# EAGLE board Stimulation_Testbed_Core_V1__Ordered (EAGLE 7.5.0), part 1 of 3
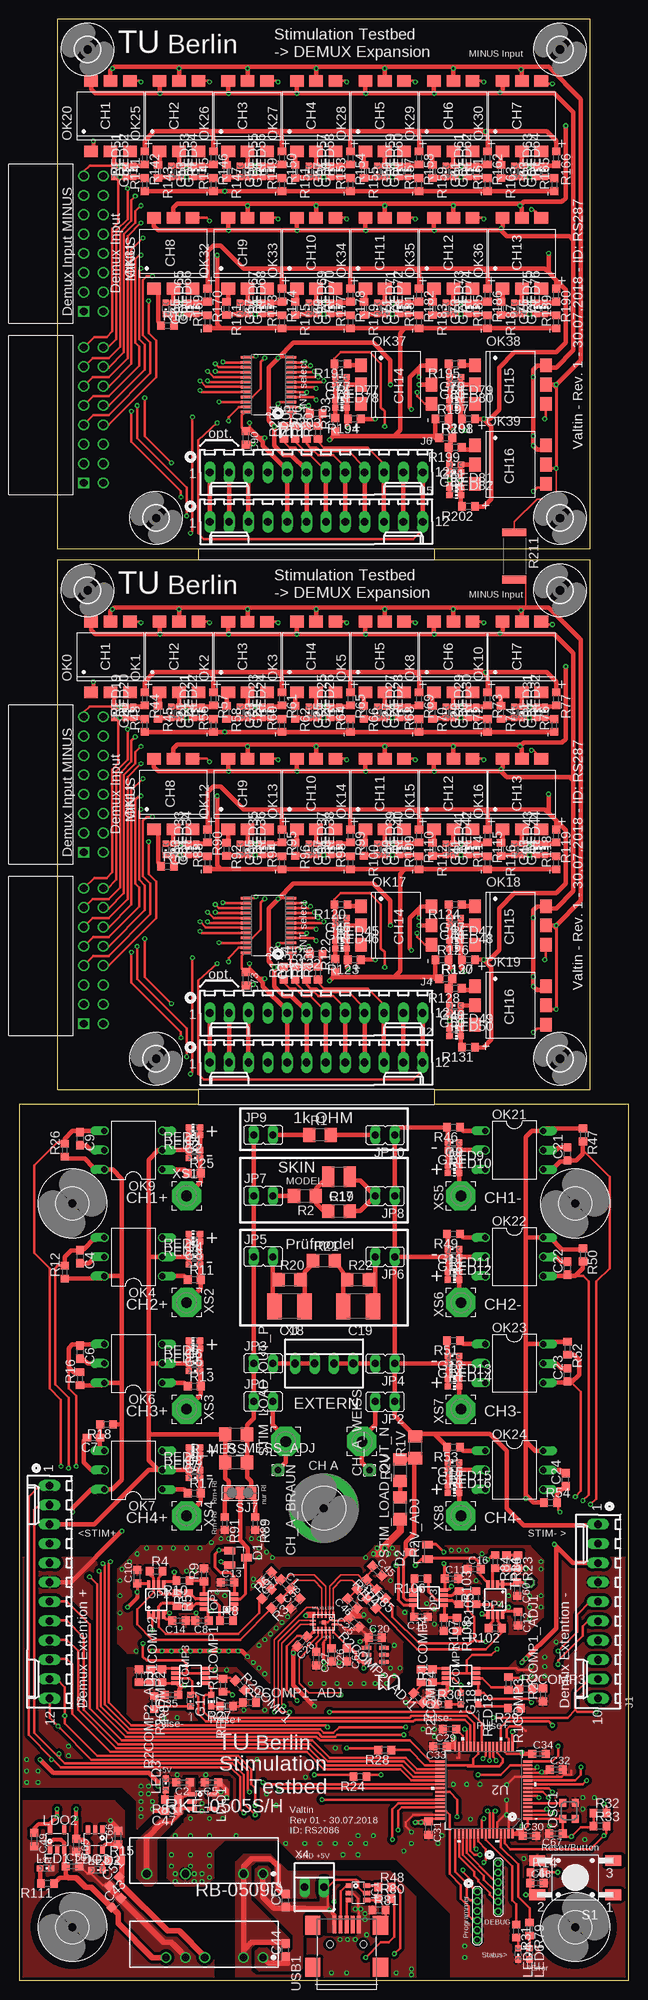
[diagram p5: board, top side]
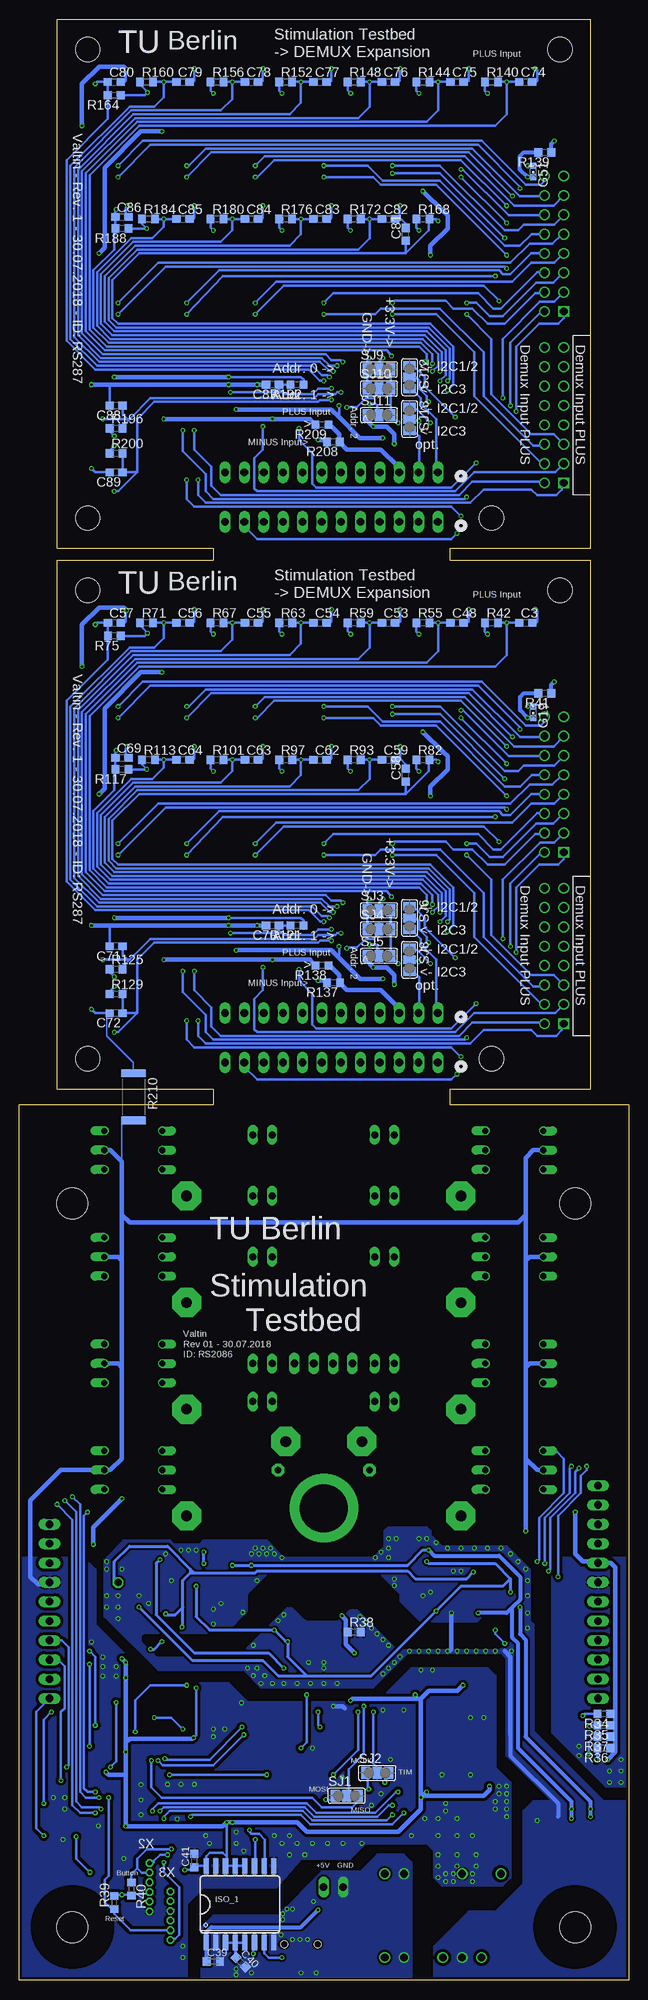
[diagram p6: board, bottom side, seen from below]

Size 80 x 257.5 mm. Coordinates in mm from the lower left corner, seen from the top.
Outline: 80,0 80,115 54.5,115 54.5,117 75,117 75,186.5 54.5,186.5 54.5,188 75,188 75,257.5 5,257.5 5,188 23.5,188 23.5,186.5 5,186.5 5,117 23.5,117 23.5,115 0,115 0,0 80,0
Copper layers (1*16): Top 0.035mm / dielectric 1.5mm / Bottom 0.035mm
Design rules "PCB-POOL Standard": minimum track width 0.15mm, minimum drill 0.3mm, track to track 0.15mm, track to pad 0.15mm, pad to pad 0.15mm, via to via 0.15mm, smd to smd 0.15mm, copper to edge 0.3mm, drill to drill 0.2mm, minimum pad ring 0.2mm, minimum via ring 0.15mm, stop-mask expansion 0.075mm, vias tented up to drill 0mil, thermal gap 0.2mm
tRestrict: area 34.8,47.8 to 44.5,53.8; area 29.2,46.8 to 31.5,51.4; area 28.9,43 to 33.6,47.5
bRestrict: area 15,43 to 63.5,53

## Footprints (pad centres in the part's own frame; a part is rotated, then mirrored left to right if it is on the bottom)
T1623CN+1 = smd 0.25 x 0.8: 1 -1.25,-1; 2 -0.75,-1; 3 -0.25,-1; 4 0.25,-1; 5 0.75,-1; 6 1.25,-1; 9 1.25,1; 10 0.75,1; 11 0.25,1; 12 -0.25,1; 13 -0.75,1; 14 -1.25,1 | smd 0.8 x 0.25: 7 1.45,-0.25; 8 1.45,0.25; 15 -1.45,0.25; 16 -1.45,-0.25 | smd 0.5 x 0.5: EXP 0,0
C0603K = smd 1.05 x 1.08: 1 -0.875,0; 2 0.875,0
C0603 = smd 1.1 x 1: 1 -0.85,0; 2 0.85,0
C1210 = smd 1.6 x 2.7: 1 -1.4,0; 2 1.4,0
C1812 = smd 1.9 x 3.4: 1 -1.95,0; 2 1.95,0
1,6/0,8 = drill 0.813 pad 1.6 octagon: 1 0,0
MSOP8 = smd 0.45 x 1: 1 -0.975,-2.05; 2 -0.325,-2.05; 3 0.325,-2.05; 4 0.975,-2.05; 5 0.975,2.05; 6 0.325,2.05; 7 -0.325,2.05; 8 -0.975,2.05
SOT23 = smd 1 x 1.4: 1 -0.95,-1.1; 2 0.95,-1.1; 3 0,1.1
MEJ2 = drill 1 pad 1.18: 1 0,0; 2 2.54,0; 5 10.16,0; 7 15.24,0
NMH = drill 1 pad 1.18: 1 0,0; 2 2.54,0; 4 7.62,0; 5 10.16,0; 6 12.7,0
CHIPLED_0603 = smd 0.8 x 0.8: A 0,-0.75; C 0,0.75
5,5-PAD = drill 6.3 pad 9: B6,3 0,0
SOT-23-6 = smd 0.6 x 0.9: 1 -0.95,-1.15; 2 0,-1.15; 3 0.95,-1.15; 4 0.95,1.15; 5 0,1.15; 6 -0.95,1.15
SOIC16WIDE = smd 0.66 x 2.032: 1 -4.445,-5.029; 2 -3.175,-5.029; 3 -1.905,-5.029; 4 -0.635,-5.029; 5 0.635,-5.029; 6 1.905,-5.029; 7 3.175,-5.029; 8 4.445,-5.029; 9 4.445,5.029; 10 3.175,5.029; 11 1.905,5.029; 12 0.635,5.029; 13 -0.635,5.029; 14 -1.905,5.029; 15 -3.175,5.029; 16 -4.445,5.029
6410-10 = drill 1.016 long: 1 11.43,0; 2 8.89,0; 3 6.35,0; 4 3.81,0; 5 1.27,0; 6 -1.27,0; 7 -3.81,0; 8 -6.35,0; 9 -8.89,0; 10 -11.43,0
6410-12 = drill 1.016 long: 1 13.97,0; 2 11.43,0; 3 8.89,0; 4 6.35,0; 5 3.81,0; 6 1.27,0; 7 -1.27,0; 8 -3.81,0; 9 -6.35,0; 10 -8.89,0; 11 -11.43,0; 12 -13.97,0
JP1 = drill 0.914 long: 1 0,-1.27; 2 0,1.27
613016243121 = drill 1.02 square: 1 -8.89,0 | drill 1.02: 2 -6.35,0; 3 -3.81,0; 4 -1.27,0; 5 1.27,0; 6 3.81,0; 7 6.35,0; 8 8.89,0; 9 8.89,-2.54; 10 6.35,-2.54; 11 3.81,-2.54; 12 1.27,-2.54; 13 -1.27,-2.54; 14 -3.81,-2.54; 15 -6.35,-2.54; 16 -8.89,-2.54
SOT-23-5 = smd 0.55 x 1.2: 1 -0.95,-1.3; 2 0,-1.3; 3 0.95,-1.3; 4 0.95,1.3; 5 -0.95,1.3
DIL6-SMD = smd 1.78 x 1.52: 1 -2.54,-4.645; 2 0,-4.645; 3 2.54,-4.645; 4 2.54,4.645; 5 0,4.645; 6 -2.54,4.645
DIL06 = drill 0.813 offset: 1 -2.54,-3.81; 2 0,-3.81; 3 2.54,-3.81; 4 2.54,3.81; 5 0,3.81; 6 -2.54,3.81
OSC_2.5X2 = smd 1 x 0.9: 1 -1.05,-0.825; 2 1.05,-0.825; 3 1.05,0.825; 4 -1.05,0.825
R1206 = smd 1.6 x 1.803: 1 -1.422,0; 2 1.422,0
R0603 = smd 1 x 1.1: 1 -0.85,0; 2 0.85,0
R6332 = smd 1 x 3.2: 1 -3.1,0; 2 3.1,0
CHIP-LED0603 = smd 0.8 x 0.8: A 0,-0.75; C 0,0.75
TAST_SMD = smd 2.1 x 1.4: 1 -5,2.25; 2 5,2.25; 3 -5,-2.25; 4 5,-2.25
SJ_2 = smd 1.168 x 1.6: 1 -1.524,0; 2 0,0; 3 1.524,0
3,81/1,4 = drill 1.397 pad 3.81 octagon: 1 0,0
TP1-09 = drill 0.9 pad 1.4 octagon: TP 0,0
SOT95P280X100-6N = smd 1.219 x 0.508: 1 -1.143,0.94; 2 -1.143,0; 3 -1.143,-0.94; 4 1.143,-0.94; 5 1.143,0; 6 1.143,0.94
LQFP64-10X10MM = smd 1.194 x 0.305: 1 -5.75,3.75; 2 -5.75,3.25; 3 -5.75,2.75; 4 -5.75,2.25; 5 -5.75,1.75; 6 -5.75,1.25; 7 -5.75,0.75; 8 -5.75,0.25; 9 -5.75,-0.25; 10 -5.75,-0.75; 11 -5.75,-1.25; 12 -5.75,-1.75; 13 -5.75,-2.25; 14 -5.75,-2.75; 15 -5.75,-3.25; 16 -5.75,-3.75; 33 5.75,-3.75; 34 5.75,-3.25; 35 5.75,-2.75; 36 5.75,-2.25; 37 5.75,-1.75; 38 5.75,-1.25; 39 5.75,-0.75; 40 5.75,-0.25; 41 5.75,0.25; 42 5.75,0.75; 43 5.75,1.25; 44 5.75,1.75; 45 5.75,2.25; 46 5.75,2.75; 47 5.75,3.25; 48 5.75,3.75 | smd 0.305 x 1.194: 17 -3.75,-5.75; 18 -3.25,-5.75; 19 -2.75,-5.75; 20 -2.25,-5.75; 21 -1.75,-5.75; 22 -1.25,-5.75; 23 -0.75,-5.75; 24 -0.25,-5.75; 25 0.25,-5.75; 26 0.75,-5.75; 27 1.25,-5.75; 28 1.75,-5.75; 29 2.25,-5.75; 30 2.75,-5.75; 31 3.25,-5.75; 32 3.75,-5.75; 49 3.75,5.75; 50 3.25,5.75; 51 2.75,5.75; 52 2.25,5.75; 53 1.75,5.75; 54 1.25,5.75; 55 0.75,5.75; 56 0.25,5.75; 57 -0.25,5.75; 58 -0.75,5.75; 59 -1.25,5.75; 60 -1.75,5.75; 61 -2.25,5.75; 62 -2.75,5.75; 63 -3.25,5.75; 64 -3.75,5.75
SOP65P640X120-24N = smd 1.473 x 0.356: 1 -2.921,3.581; 2 -2.921,2.921; 3 -2.921,2.286; 4 -2.921,1.626; 5 -2.921,0.965; 6 -2.921,0.33; 7 -2.921,-0.33; 8 -2.921,-0.965; 9 -2.921,-1.626; 10 -2.921,-2.286; 11 -2.921,-2.921; 12 -2.921,-3.581; 13 2.921,-3.581; 14 2.921,-2.921; 15 2.921,-2.286; 16 2.921,-1.626; 17 2.921,-0.965; 18 2.921,-0.33; 19 2.921,0.33; 20 2.921,0.965; 21 2.921,1.626; 22 2.921,2.286; 23 2.921,2.921; 24 2.921,3.581
4,1 = hole 4.1: 0,0
3,2 = hole 3.2: 0,0
TE_1-1734035-1 = smd 0.5 x 2.3: 1 -1.6,7.85; 2 -0.8,7.85; 3 0,7.85; 4 0.8,7.85; 5 1.6,7.85 | smd 2 x 2.5: 7 4.45,7.75; 8 -4.45,7.75; 9 -4.45,2.25; 10 4.45,2.25 | hole 0.9: -2.2,5.25; 2.2,5.25
22-23-2041 = drill 1 long: 1 -3.81,0; 2 -1.27,0; 3 1.27,0; 4 3.81,0
1.27_1X06_S = drill 0.6 pad 0.813 octagon: P1 0.635,3.175; P2 0.635,1.905; P3 0.635,0.635; P4 0.635,-0.635; P5 0.635,-1.905; P6 0.635,-3.175
22-23-2021 = drill 1 long: 1 -1.27,0; 2 1.27,0

## Placement (x,y rotation side)
ADC1  MAX11198  [T1623CN+1]  40,47 180 top
C1  1nF/25V/C0G/5%  [C0603K]  35,52 315 top
C2  1uF/25V/X7R/10%  [C0603K]  21.5,26 180 top
C3  1nF/25V/X7R/10%  [C0603]  13.5,178.25 0 bottom
C4  1nF/25V/X7R/10%  [C0603]  8,95 270 top
C5  1uF/25V/X7R/10%  [C0603K]  25.25,26 180 top
C6  1nF/25V/X7R/10%  [C0603]  8,82.5 270 top
C7  1nF/25V/X7R/10%  [C0603]  9.75,71.25 180 top
C8  100nF/25V/X7R/10%  [C0603K]  24,47.25 180 top
C9  1nF/25V/X7R/10%  [C0603]  8,110.5 270 top
C10  100nF/25V/X7R/10%  [C0603K]  15.5,53 90 top
C11  100nF/25V/X7R/10%  [C0603K]  56.75,52.75 0 top
C12  100nF/25V/X7R/10%  [C0603K]  65.5,47.5 270 top
C13  100nF/25V/X7R/10%  [C0603K]  27.38,52.25 0 top
C14  100nF/25V/X7R/10%  [C0603K]  21,47.25 180 top
C15  100nF/25V/X7R/10%  [C0603K]  52.75,47.75 180 top
C16  100nF/25V/X7R/10%  [C0603K]  59.75,54 0 top
C17  220nF/250V/X7R/10%  [C1210]  42,105.5 180 top
C18  330nF/250V/X7R/10%  [C1812]  35.5,88.5 180 top
C19  330nF/250V/X7R/10%  [C1812]  44.5,88.5 180 top
C20  100nF/25V/X7R/10%  [C0603K]  46.75,45 0 top
C21  1nF/25V/X7R/10%  [C0603]  72,108.5 90 top
C22  1nF/25V/X7R/10%  [C0603]  72,93.5 90 top
C23  1nF/25V/X7R/10%  [C0603]  72,79.5 90 top
C24  1nF/25V/X7R/10%  [C0603]  71.75,65.75 90 top
C25  10uF/25V/X7R/10%  [C0603K]  44,47 135 top
C26  10uF/25V/X7R/10%  [C0603K]  41,42.75 270 top
C27  10uF/25V/X7R/10%  [C0603K]  39,42.25 270 top
C28  10uF/25V/X7R/10%  [C0603K]  37.15,44.5 225 top
C29  4.7uF/25V/X7R/10%  [C0603K]  56.5,33 180 top
C30  4.7uF/25V/X7R/10%  [C0603K]  67,19 0 top
C31  4.7uF/25V/X7R/10%  [C0603K]  53.75,20 270 top
C32  4.7uF/25V/X7R/10%  [C0603K]  70.5,27.7 0 top
C33  4.7uF/25V/X7R/10%  [C0603K]  55.25,30.75 180 top
C34  4.7uF/25V/X7R/10%  [C0603K]  68.25,29.75 0 top
C35  100nF/25V/X7R/10%  [C0603K]  20,37.5 180 top
C36  100nF/25V/X7R/10%  [C0603K]  54.75,37.75 180 top
C37  0.1nF/25V/C0G/5%  [C0603K]  32.5,53 225 top
C38  0.1nF/25V/C0G/5%  [C0603K]  36.25,49.5 45 top
C39  100nF/25V/X7R/10%  [C0603K]  54.5,2.5 0 bottom
C40  100nF/25V/X7R/10%  [C0603K]  50.9,2.4 315 bottom
C41  100nF/25V/X7R/10%  [C0603K]  57,15.75 90 bottom
C42  1nF/25V/C0G/5%  [C0603K]  45,52 225 top
C43  4.7u/25V/X7R  [C0603]  12.77,10.2 45 top
C44  4.7u/15V/X7R  [C0603]  35,4 90 top
C45  0.1nF/25V/C0G/5%  [C0603K]  47,53.75 315 top
C46  0.1nF/25V/C0G/5%  [C0603K]  43.75,49.5 135 top
C47  4.7u/25V/X7R  [C0603]  20,22.25 180 top
C48  1nF/25V/X7R/10%  [C0603]  22.5,178.25 0 bottom
C49  1uF/25V/X7R/10%  [C0603K]  2,18.5 270 top
C50  1uF/25V/X7R/10%  [C0603K]  7,15 0 top
C51  4.7u/25V/X7R  [C0603]  12.5,13 45 top
C52  4.7u/25V/X7R  [C0603]  35,10.5 90 top
C53  1nF/25V/X7R/10%  [C0603]  31.5,178.25 0 bottom
C54  1nF/25V/X7R/10%  [C0603]  40.5,178.25 0 bottom
C55  1nF/25V/X7R/10%  [C0603]  49.5,178.25 0 bottom
C56  1nF/25V/X7R/10%  [C0603]  58.5,178.25 0 bottom
C57  1nF/25V/X7R/10%  [C0603]  67.5,178.25 0 bottom
C58  1nF/25V/X7R/10%  [C0603]  29.25,158.25 90 bottom
C59  1nF/25V/X7R/10%  [C0603]  31.5,160.25 0 bottom
C60  NC -> can't handle C load  [C0603K]  65.39,51.36 270 top
C61  1uF/25V/X7R/10%  [C0603K]  43,42.75 270 top
C62  1nF/25V/X7R/10%  [C0603]  40.5,160.25 0 bottom
C63  1nF/25V/X7R/10%  [C0603]  49.5,160.25 0 bottom
C64  1nF/25V/X7R/10%  [C0603]  58.5,160.25 0 bottom
C65  4.7uF/25V/X7R/10%  [C0603K]  7.5,17.75 270 top
C66  1uF/25V/X7R/10%  [C0603K]  13,18.75 90 top
C67  100nF/25V/X7R/10%  [C0603K]  70.48,19.28 180 top
C68  100nF/25V/X7R/10%  [C0603K]  68,12.8 0 top
C69  1nF/25V/X7R/10%  [C0603]  66.5,160.5 0 bottom
C70  1nF/25V/X7R/10%  [C0603]  46.75,138.5 180 bottom
C71  1nF/25V/X7R/10%  [C0603]  67.25,135.75 180 bottom
C72  1nF/25V/X7R/10%  [C0603]  67.25,127 180 bottom
C73  100nF/25V/X7R/10%  [C0603K]  29.75,131.5 270 top
C74  1nF/25V/X7R/10%  [C0603]  13.5,249.25 0 bottom
C75  1nF/25V/X7R/10%  [C0603]  22.5,249.25 0 bottom
C76  1nF/25V/X7R/10%  [C0603]  31.5,249.25 0 bottom
C77  1nF/25V/X7R/10%  [C0603]  40.5,249.25 0 bottom
C78  1nF/25V/X7R/10%  [C0603]  49.5,249.25 0 bottom
C79  1nF/25V/X7R/10%  [C0603]  58.5,249.25 0 bottom
C80  1nF/25V/X7R/10%  [C0603]  67.5,249.25 0 bottom
C81  1nF/25V/X7R/10%  [C0603]  29.25,229.25 90 bottom
C82  1nF/25V/X7R/10%  [C0603]  31.5,231.25 0 bottom
C83  1nF/25V/X7R/10%  [C0603]  40.5,231.25 0 bottom
C84  1nF/25V/X7R/10%  [C0603]  49.5,231.25 0 bottom
C85  1nF/25V/X7R/10%  [C0603]  58.5,231.25 0 bottom
C86  1nF/25V/X7R/10%  [C0603]  66.5,231.5 0 bottom
C87  1nF/25V/X7R/10%  [C0603]  46.75,209.5 180 bottom
C88  1nF/25V/X7R/10%  [C0603]  67.25,206.75 180 bottom
C89  1nF/25V/X7R/10%  [C0603]  67.25,198 180 bottom
C90  100nF/25V/X7R/10%  [C0603K]  29.75,202.5 270 top
CH_A_BRAUN  [1,6/0,8]  34,67 270 top
CH_A_WEISS  [1,6/0,8]  46,67 90 top
COMP1  TS3022IST  [MSOP8]  58,40 90 top
COMP3  TS3022IST  [MSOP8]  22.5,40 90 top
D1  BAS70-04  [SOT23]  28.75,55.5 270 top
D2  BAS70-04  [SOT23]  52.5,56.25 90 top
DC-DC_3V3  RKE-0505S/H  [MEJ2]  32,14 180 top
DC-DC_9V  RB-0509D  [NMH]  32,3 180 top
G1  150060VS75000  [CHIPLED_0603]  23,109 270 top
G2  150060VS75000  [CHIPLED_0603]  23,108 270 top
G3  150060VS75000  [CHIPLED_0603]  23,94 270 top
G4  150060VS75000  [CHIPLED_0603]  23,95 270 top
G5  150060VS75000  [CHIPLED_0603]  23,80 270 top
G6  150060VS75000  [CHIPLED_0603]  23,81 270 top
G7  150060VS75000  [CHIPLED_0603]  23,66 270 top
G8  150060VS75000  [CHIPLED_0603]  23,67 270 top
G9  150060VS75000  [CHIPLED_0603]  57,110 90 top
G10  150060VS75000  [CHIPLED_0603]  57,109 90 top
G11  150060VS75000  [CHIPLED_0603]  57,96 90 top
G12  150060VS75000  [CHIPLED_0603]  57,95 90 top
G13  150060VS75000  [CHIPLED_0603]  57,82 90 top
G14  150060VS75000  [CHIPLED_0603]  57,81 90 top
G15  150060VS75000  [CHIPLED_0603]  57,68 90 top
G16  150060VS75000  [CHIPLED_0603]  57,67 90 top
G17  150060VS75000  [CHIPLED_0603]  22.5,36.75 180 top
G18  150060VS75000  [CHIPLED_0603]  58,37 180 top
G19  150060VS75000  [CHIPLED_0603]  12.5,166.5 180 bottom
G20  150060VS75000  [CHIPLED_0603]  12.5,166.5 180 top
G21  150060VS75000  [CHIPLED_0603]  20,166.5 180 top
G22  150060VS75000  [CHIPLED_0603]  21,166.5 180 top
G23  150060VS75000  [CHIPLED_0603]  29,166.49 180 top
G24  150060VS75000  [CHIPLED_0603]  30,166.49 180 top
G25  150060VS75000  [CHIPLED_0603]  38,166.5 180 top
G26  150060VS75000  [CHIPLED_0603]  39,166.5 180 top
G27  150060VS75000  [CHIPLED_0603]  47,166.5 180 top
G28  150060VS75000  [CHIPLED_0603]  48,166.5 180 top
G29  150060VS75000  [CHIPLED_0603]  56,166.5 180 top
G30  150060VS75000  [CHIPLED_0603]  57,166.5 180 top
G31  150060VS75000  [CHIPLED_0603]  65,166.5 180 top
G32  150060VS75000  [CHIPLED_0603]  66,166.5 180 top
G33  150060VS75000  [CHIPLED_0603]  19.25,148.5 180 top
G34  150060VS75000  [CHIPLED_0603]  20.25,148.5 180 top
G35  150060VS75000  [CHIPLED_0603]  29,148.5 180 top
G36  150060VS75000  [CHIPLED_0603]  30,148.5 180 top
G37  150060VS75000  [CHIPLED_0603]  38,148.5 180 top
G38  150060VS75000  [CHIPLED_0603]  39,148.5 180 top
G39  150060VS75000  [CHIPLED_0603]  47,148.5 180 top
G40  150060VS75000  [CHIPLED_0603]  48,148.5 180 top
G41  150060VS75000  [CHIPLED_0603]  56,148.5 180 top
G42  150060VS75000  [CHIPLED_0603]  57,148.5 180 top
G43  150060VS75000  [CHIPLED_0603]  65,148.5 180 top
G44  150060VS75000  [CHIPLED_0603]  66,148.5 180 top
G45  150060VS75000  [CHIPLED_0603]  42.25,139.5 90 top
G46  150060VS75000  [CHIPLED_0603]  42.25,138.5 90 top
G47  150060VS75000  [CHIPLED_0603]  57.25,139.5 90 top
G48  150060VS75000  [CHIPLED_0603]  57.25,138.5 90 top
G49  150060VS75000  [CHIPLED_0603]  57.25,128 90 top
G50  150060VS75000  [CHIPLED_0603]  57.25,127 90 top
G51  150060VS75000  [CHIPLED_0603]  12.5,237.5 180 bottom
G52  150060VS75000  [CHIPLED_0603]  12.5,237.5 180 top
G53  150060VS75000  [CHIPLED_0603]  20,237.5 180 top
G54  150060VS75000  [CHIPLED_0603]  21,237.5 180 top
G55  150060VS75000  [CHIPLED_0603]  29,237.49 180 top
G56  150060VS75000  [CHIPLED_0603]  30,237.49 180 top
G57  150060VS75000  [CHIPLED_0603]  38,237.5 180 top
G58  150060VS75000  [CHIPLED_0603]  39,237.5 180 top
G59  150060VS75000  [CHIPLED_0603]  47,237.5 180 top
G60  150060VS75000  [CHIPLED_0603]  48,237.5 180 top
G61  150060VS75000  [CHIPLED_0603]  56,237.5 180 top
G62  150060VS75000  [CHIPLED_0603]  57,237.5 180 top
G63  150060VS75000  [CHIPLED_0603]  65,237.5 180 top
G64  150060VS75000  [CHIPLED_0603]  66,237.5 180 top
G65  150060VS75000  [CHIPLED_0603]  19.25,219.5 180 top
G66  150060VS75000  [CHIPLED_0603]  20.25,219.5 180 top
G67  150060VS75000  [CHIPLED_0603]  29,219.5 180 top
G68  150060VS75000  [CHIPLED_0603]  30,219.5 180 top
G69  150060VS75000  [CHIPLED_0603]  38,219.5 180 top
G70  150060VS75000  [CHIPLED_0603]  39,219.5 180 top
G71  150060VS75000  [CHIPLED_0603]  47,219.5 180 top
G72  150060VS75000  [CHIPLED_0603]  48,219.5 180 top
G73  150060VS75000  [CHIPLED_0603]  56,219.5 180 top
G74  150060VS75000  [CHIPLED_0603]  57,219.5 180 top
G75  150060VS75000  [CHIPLED_0603]  65,219.5 180 top
G76  150060VS75000  [CHIPLED_0603]  66,219.5 180 top
G77  150060VS75000  [CHIPLED_0603]  42.25,210.5 90 top
G78  150060VS75000  [CHIPLED_0603]  42.25,209.5 90 top
G79  150060VS75000  [CHIPLED_0603]  57.25,210.5 90 top
G80  150060VS75000  [CHIPLED_0603]  57.25,209.5 90 top
G81  150060VS75000  [CHIPLED_0603]  57.25,199 90 top
G82  150060VS75000  [CHIPLED_0603]  57.25,198 90 top
H1  BINDER_STIM  [5,5-PAD]  40,62 270 top
IC1  USBLC6-2  [SOT-23-6]  44.5,11.5 270 top
ISO_1  ADUM4160  [SOIC16WIDE]  51,10 0 bottom
J1  22-27-2101-10  [6410-10]  76,48.45 90 top
J2  22-27-2121-12  [6410-12]  39,120.5 180 top
J3  22-27-2121-12  [6410-12]  4,51 90 top
J4  22-27-2121-12  [6410-12]  39,127 180 top
J5  22-27-2121-12  [6410-12]  39,191.5 180 top
J6  22-27-2121-12  [6410-12]  39,198 180 top
JP1  [JP1]  32.05,76 270 top
JP2  [JP1]  48.05,76 90 top
JP3  [JP1]  32.05,81 270 top
JP4  [JP1]  48.05,81 90 top
JP5  [JP1]  32.05,95 270 top
JP6  [JP1]  48.05,95 90 top
JP7  [JP1]  32.05,103 270 top
JP8  [JP1]  48.05,103 90 top
JP9  [JP1]  32.05,111 270 top
JP10  [JP1]  48.05,111 90 top
K1  613016243121  [613016243121]  8.5,205.5 90 top
K2  613016243121  [613016243121]  8.5,134.5 90 top
K3  613016243121  [613016243121]  8.5,157 90 top
K4  613016243121  [613016243121]  8.5,228 90 top
LDO1  LDK220U33R ->3.3V  [SOT-23-5]  24,23.5 270 top
LDO2  LDK220M50R ->5V  [SOT-23-5]  5,18.5 0 top
LDO3  MIC5270-5.0YM5  [SOT-23-5]  10,18.5 180 top
LED1  [CHIPLED_0603]  3.5,14.75 270 top
LED2  [CHIPLED_0603]  10.25,14.5 270 top
LED3  [CHIPLED_0603]  19.25,25.75 0 top
LED4  Green  [CHIPLED_0603]  65.5,3.5 180 top
LED6  Red  [CHIPLED_0603]  67,3.5 180 top
OK0  H11L1MS  [DIL6-SMD]  12,173.75 0 top
OK1  H11L1MS  [DIL6-SMD]  21,173.75 0 top
OK2  H11L1MS  [DIL6-SMD]  30,173.74 0 top
OK3  H11L1MS  [DIL6-SMD]  39,173.75 0 top
OK4  H11L1M  [DIL06]  15,95 90 top
OK5  H11L1MS  [DIL6-SMD]  48,173.75 0 top
OK6  H11L1M  [DIL06]  15,81 90 top
OK7  H11L1M  [DIL06]  15,67 90 top
OK8  H11L1MS  [DIL6-SMD]  57,173.75 0 top
OK9  H11L1M  [DIL06]  15,109 90 top
OK10  H11L1MS  [DIL6-SMD]  66,173.75 0 top
OK11  H11L1MS  [DIL6-SMD]  20.25,155.75 0 top
OK12  H11L1MS  [DIL6-SMD]  30,155.75 0 top
OK13  H11L1MS  [DIL6-SMD]  39,155.75 0 top
OK14  H11L1MS  [DIL6-SMD]  48,155.75 0 top
OK15  H11L1MS  [DIL6-SMD]  57,155.75 0 top
OK16  H11L1MS  [DIL6-SMD]  66,155.75 0 top
OK17  H11L1MS  [DIL6-SMD]  49.5,138.5 270 top
OK18  H11L1MS  [DIL6-SMD]  64.5,138.5 270 top
OK19  H11L1MS  [DIL6-SMD]  64.5,128 270 top
OK20  H11L1MS  [DIL6-SMD]  12,244.75 0 top
OK21  H11L1M  [DIL06]  65,109 270 top
OK22  H11L1M  [DIL06]  65,95 270 top
OK23  H11L1M  [DIL06]  65,81 270 top
OK24  H11L1M  [DIL06]  65,67 270 top
OK25  H11L1MS  [DIL6-SMD]  21,244.75 0 top
OK26  H11L1MS  [DIL6-SMD]  30,244.74 0 top
OK27  H11L1MS  [DIL6-SMD]  39,244.75 0 top
OK28  H11L1MS  [DIL6-SMD]  48,244.75 0 top
OK29  H11L1MS  [DIL6-SMD]  57,244.75 0 top
OK30  H11L1MS  [DIL6-SMD]  66,244.75 0 top
OK31  H11L1MS  [DIL6-SMD]  20.25,226.75 0 top
OK32  H11L1MS  [DIL6-SMD]  30,226.75 0 top
OK33  H11L1MS  [DIL6-SMD]  39,226.75 0 top
OK34  H11L1MS  [DIL6-SMD]  48,226.75 0 top
OK35  H11L1MS  [DIL6-SMD]  57,226.75 0 top
OK36  H11L1MS  [DIL6-SMD]  66,226.75 0 top
OK37  H11L1MS  [DIL6-SMD]  49.5,209.5 270 top
OK38  H11L1MS  [DIL6-SMD]  64.5,209.5 270 top
OK39  H11L1MS  [DIL6-SMD]  64.5,199 270 top
OP1  LT1723CMS8#PBF  [MSOP8]  26.25,49.75 90 top
OP2  LT1723CMS8#PBF  [MSOP8]  18,50 0 top
OP3  LT1723CMS8#PBF  [MSOP8]  53.75,50.25 270 top
OP4  LT1723CMS8#PBF  [MSOP8]  62.5,50 180 top
OSC1  DSC6011JI2A-008.0000 / X1G004171001512  [OSC_2.5X2]  72.18,22.27 90 top
R1  0.997k  [R1206]  39.5,111 0 top
R1COMP1  7.5k  [R0603]  26.75,38.75 90 top
R1COMP2  7.5k  [R0603]  18.75,40 90 top
R1COMP3  7.5k  [R0603]  64.25,39 270 top
R1COMP4  7.5k  [R0603]  54.25,40 90 top
R1V  1.492Meg  [R1206]  52,70 90 top
R2  470R  [R1206]  37.5,103 180 top
R2COMP1  4.3k  [R0603]  29,38.75 315 top
R2COMP1_ADJ  200  [R0603]  30.25,36.5 0 top
R2COMP1_ADJ1  180  [R0603]  68.75,37.5 90 top
R2COMP2  4.7k  [R0603]  17.25,40 270 top
R2COMP2_ADJ  180  [R0603]  15.75,40 270 top
R2COMP2_ADJ1  200  [R0603]  52.4,37.1 135 top
R2COMP3  4.7k  [R0603]  66.5,38.25 0 top
R2COMP4  4.3k  [R0603]  52.75,40 270 top
R2V  9.981k  [R1206]  50,67 90 top
R2V_ADJ  0  [R1206]  50,62 270 top
R3  51R  [R0603]  33.75,49.5 225 top
R4  1k  [R0603]  18,53.75 0 top
R5  1k  [R0603]  20.75,50 270 top
R6  51R  [R0603]  32.5,50.75 45 top
R7  1k  [R0603]  22.25,50 90 top
R8  1k  [R0603]  27.25,47.25 0 top
R9  1k  [R0603]  24.25,53.25 90 top
R10  1k  [R0603]  21.5,52.5 180 top
R11  51  [R0603]  23,92 0 top
R12  100k  [R0603]  6,93 90 top
R13  51  [R0603]  23,78 0 top
R14  100k/1%  [R0603]  68,14.2 0 top
R15  2k/1%  [R0603]  12.5,15.75 0 top
R16  100k  [R0603]  8,79 90 top
R17  51  [R0603]  23,64 0 top
R18  100k  [R0603]  11.5,73 180 top
R19  2k7  [R1206]  42,101 0 top
R20  1k8  [R1206]  35.5,92 0 top
R21  1k  [R1206]  40,94.5 0 top
R22  1k8  [R1206]  44.5,92 0 top
R23  0R  [R0603]  65.5,55 270 top
R24  0R  [R0603]  44.75,26.75 180 top
R25  51  [R0603]  23,106 0 top
R26  100k  [R0603]  6,109 90 top
R27  1k/1%  [R0603]  27.25,36 180 top
R28  0R  [R0603]  48,30.25 180 top
R29  1k/1%  [R0603]  65,35.75 180 top
R30  1k/1%  [R0603]  55.5,36.25 0 top
R31  1.5k/1%  [R0603]  65.25,6.5 270 top
R32  4k7/1%  [R0603]  76.25,22 0 top
R33  4k7/1%  [R0603]  76.25,20.25 0 top
R34  4k7/1%  [R0603]  3.25,35 180 bottom
R35  4k7/1%  [R0603]  3.25,33.5 180 bottom
R36  4k7/1%  [R0603]  3.25,30.5 180 bottom
R37  4k7/1%  [R0603]  3.25,32 180 bottom
R38  NA/0R/1%  [R0603]  36,45.75 0 bottom
R39  0/1%  [R0603]  67.5,10.25 90 bottom
R40  0/1%  [R0603]  65.25,12 270 bottom
R41  51  [R0603]  11,169 180 bottom
R42  100k  [R0603]  18,178.25 0 bottom
R43  NA/0R  [R0603]  16.5,164.75 90 top
R44  NA/0R  [R0603]  16.5,168.25 270 top
R45  51  [R0603]  18.25,166.5 270 top
R46  51  [R0603]  57,112 180 top
R47  100k  [R0603]  74,111 270 top
R48  24/1%  [R0603]  48,12.25 0 top
R49  51  [R0603]  57,98 180 top
R50  100k  [R0603]  74,95.25 270 top
R51  51  [R0603]  57,84 180 top
R52  100k  [R0603]  72,83 270 top
R53  51  [R0603]  57,70 180 top
R54  100k  [R0603]  69.75,62.75 0 top
R55  100k  [R0603]  27,178.25 0 bottom
R56  NA/0R  [R0603]  25.5,164.75 90 top
R57  NA/0R  [R0603]  25.5,168.25 270 top
R58  51  [R0603]  27.25,166.49 270 top
R59  100k  [R0603]  36,178.25 0 bottom
R60  NA/0R  [R0603]  34.5,164.75 90 top
R61  NA/0R  [R0603]  34.5,168.25 270 top
R62  51  [R0603]  36.25,166.5 270 top
R63  100k  [R0603]  45,178.25 0 bottom
R64  NA/0R  [R0603]  43.5,164.75 90 top
R65  NA/0R  [R0603]  43.5,168.25 270 top
R66  51  [R0603]  45.25,166.5 270 top
R67  100k  [R0603]  54,178.25 0 bottom
R68  NA/0R  [R0603]  52.5,164.75 90 top
R69  NA/0R  [R0603]  52.5,168.25 270 top
R70  51  [R0603]  54.25,166.5 270 top
R71  100k  [R0603]  63.25,178.25 0 bottom
R72  NA/0R  [R0603]  61.5,164.75 90 top
R73  NA/0R  [R0603]  61.5,168.25 270 top
R74  51  [R0603]  63.25,166.5 270 top
R75  100k  [R0603]  67.5,176.5 180 bottom
R76  NA/0R  [R0603]  70.25,164.75 90 top
R77  NA/0R  [R0603]  70.5,168.25 270 top
R78  51  [R0603]  19.5,146.25 0 top
R79  1.5k/1%  [R0603]  67,6.75 270 top
R80  24/1%  [R0603]  48,10.75 0 top
R81  10/5%  [R0603]  47.25,9.25 0 top
R82  100k  [R0603]  27,160.25 0 bottom
R83  1k/1%  [R0603]  20,23.75 180 top
R84  100k  [R0603]  62.5,55 270 top
R85  51R  [R0603]  46.25,49.5 315 top
R86  100k  [R0603]  64,55 270 top
R87  1k/1%  [R0603]  17.75,36.5 270 top
R88  NA/0R  [R0603]  24.75,146.75 90 top
R89  0R or NA  [R0603]  31,60 270 top
R90  NA/0R  [R0603]  24.75,150.25 270 top
R91  NA or 0R  [R0603]  27,60 270 top
R92  51  [R0603]  27.25,148.5 270 top
R93  100k  [R0603]  36,160.25 0 bottom
R94  NA/0R  [R0603]  34.5,146.75 90 top
R95  NA/0R  [R0603]  34.5,150.25 270 top
R96  51  [R0603]  36.25,148.5 270 top
R97  100k  [R0603]  45,160.25 0 bottom
R98  NA/0R  [R0603]  43.5,146.75 90 top
R99  NA/0R  [R0603]  43.5,150.25 270 top
R100  51  [R0603]  45.25,148.5 270 top
R101  100k  [R0603]  54,160.25 0 bottom
R102  1k  [R0603]  62.5,46.25 180 top
R103  1k  [R0603]  60,50.25 90 top
R104  51R  [R0603]  47.5,50.75 135 top
R105  1k  [R0603]  57.75,50.25 270 top
R106  1k  [R0603]  52.75,52.75 180 top
R107  1k  [R0603]  55.75,46.75 270 top
R108  1k  [R0603]  57.5,46.75 270 top
R109  NA/0R  [R0603]  52.5,146.75 90 top
R110  NA/0R  [R0603]  52.5,150.25 270 top
R111  2k/1%  [R0603]  3.75,12.75 180 top
R112  51  [R0603]  54.25,148.5 270 top
R113  100k  [R0603]  63,160.25 0 bottom
R114  NA/0R  [R0603]  61.5,146.75 90 top
R115  NA/0R  [R0603]  61.5,150.25 270 top
R116  51  [R0603]  63.25,148.5 270 top
R117  100k  [R0603]  66.5,159 180 bottom
R118  NA/0R  [R0603]  70.5,146.75 90 top
R119  NA/0R  [R0603]  70.5,150.25 270 top
R120  51  [R0603]  42.25,141.25 180 top
R121  100k  [R0603]  43.5,138.5 180 bottom
R122  NA/0R  [R0603]  41.5,133.25 90 top
R123  NA/0R  [R0603]  44,134 180 top
R124  51  [R0603]  57.25,141.25 180 top
R125  100k  [R0603]  67.25,132.75 0 bottom
R126  NA/0R  [R0603]  55.5,134 0 top
R127  NA/0R  [R0603]  59,134 180 top
R128  51  [R0603]  57.25,130.25 180 top
R129  100k  [R0603]  67.25,129.5 0 bottom
R130  NA/0R  [R0603]  56,131.5 0 top
R131  NA/0R  [R0603]  59,122.5 180 top
R132  33k/10%  [R0603]  39,134.75 180 top
R133  NA/0R  [R0603]  34.75,132.25 90 top
R134  NA/0R  [R0603]  36.25,132.25 90 top
R135  NA/0R  [R0603]  37.75,132.25 90 top
R136  NA/0R  [R0603]  39.25,132.25 90 top
R137  NA/0R  [R0603]  38.75,131 180 bottom
R138  NA/0R  [R0603]  40.25,133.25 180 bottom
R139  51  [R0603]  11,240 180 bottom
R140  100k  [R0603]  18,249.25 0 bottom
R141  NA/0R  [R0603]  16.5,235.75 90 top
R142  NA/0R  [R0603]  16.5,239.25 270 top
R143  51  [R0603]  18.25,237.5 270 top
R144  100k  [R0603]  27,249.25 0 bottom
R145  NA/0R  [R0603]  25.5,235.75 90 top
R146  NA/0R  [R0603]  25.5,239.25 270 top
R147  51  [R0603]  27.25,237.49 270 top
R148  100k  [R0603]  36,249.25 0 bottom
R149  NA/0R  [R0603]  34.5,235.75 90 top
R150  NA/0R  [R0603]  34.5,239.25 270 top
R151  51  [R0603]  36.25,237.5 270 top
R152  100k  [R0603]  45,249.25 0 bottom
R153  NA/0R  [R0603]  43.5,235.75 90 top
R154  NA/0R  [R0603]  43.5,239.25 270 top
R155  51  [R0603]  45.25,237.5 270 top
R156  100k  [R0603]  54,249.25 0 bottom
R157  NA/0R  [R0603]  52.5,235.75 90 top
R158  NA/0R  [R0603]  52.5,239.25 270 top
R159  51  [R0603]  54.25,237.5 270 top
R160  100k  [R0603]  63.25,249.25 0 bottom
R161  NA/0R  [R0603]  61.5,235.75 90 top
R162  NA/0R  [R0603]  61.5,239.25 270 top
R163  51  [R0603]  63.25,237.5 270 top
R164  100k  [R0603]  67.5,247.5 180 bottom
R165  NA/0R  [R0603]  70.25,235.75 90 top
R166  NA/0R  [R0603]  70.5,239.25 270 top
R167  51  [R0603]  19.5,217.25 0 top
R168  100k  [R0603]  27,231.25 0 bottom
R169  NA/0R  [R0603]  24.75,217.75 90 top
R170  NA/0R  [R0603]  24.75,221.25 270 top
R171  51  [R0603]  27.25,219.5 270 top
R172  100k  [R0603]  36,231.25 0 bottom
R173  NA/0R  [R0603]  34.5,217.75 90 top
R174  NA/0R  [R0603]  34.5,221.25 270 top
R175  51  [R0603]  36.25,219.5 270 top
R176  100k  [R0603]  45,231.25 0 bottom
R177  NA/0R  [R0603]  43.5,217.75 90 top
R178  NA/0R  [R0603]  43.5,221.25 270 top
R179  51  [R0603]  45.25,219.5 270 top
R180  100k  [R0603]  54,231.25 0 bottom
R181  NA/0R  [R0603]  52.5,217.75 90 top
R182  NA/0R  [R0603]  52.5,221.25 270 top
R183  51  [R0603]  54.25,219.5 270 top
R184  100k  [R0603]  63,231.25 0 bottom
R185  NA/0R  [R0603]  61.5,217.75 90 top
R186  NA/0R  [R0603]  61.5,221.25 270 top
R187  51  [R0603]  63.25,219.5 270 top
R188  100k  [R0603]  66.5,230 180 bottom
R189  NA/0R  [R0603]  70.5,217.75 90 top
R190  NA/0R  [R0603]  70.5,221.25 270 top
R191  51  [R0603]  42.25,212.25 180 top
R192  100k  [R0603]  43.5,209.5 180 bottom
R193  NA/0R  [R0603]  41.5,204.25 90 top
R194  NA/0R  [R0603]  44,205 180 top
R195  51  [R0603]  57.25,212.25 180 top
R196  100k  [R0603]  67.25,203.75 0 bottom
R197  NA/0R  [R0603]  55.5,205 0 top
R198  NA/0R  [R0603]  59,205 180 top
R199  51  [R0603]  57.25,201.25 180 top
R200  100k  [R0603]  67.25,200.5 0 bottom
R201  NA/0R  [R0603]  56,202.5 0 top
R202  NA/0R  [R0603]  59,193.5 180 top
R203  33k/10%  [R0603]  39,205.75 180 top
R204  NA/0R  [R0603]  34.75,203.25 90 top
R205  NA/0R  [R0603]  36.25,203.25 90 top
R206  NA/0R  [R0603]  37.75,203.25 90 top
R207  NA/0R  [R0603]  39.25,203.25 90 top
R208  NA/0R  [R0603]  38.75,202 180 bottom
R209  NA/0R  [R0603]  40.25,204.25 180 bottom
R210  NA/0R  [R6332]  65,116 270 bottom
R211  NA/0R  [R6332]  65,187 270 top
R_MESS  6.79Ohm  [R1206]  28.5,71.7 180 top
R_MESS_ADJ  [R1206]  28.5,68 0 top
RED1  150060RS75000  [CHIP-LED0603]  23,112 90 top
RED2  150060RS75000  [CHIP-LED0603]  23,111 90 top
RED3  150060RS75000  [CHIP-LED0603]  23,97 90 top
RED4  150060RS75000  [CHIP-LED0603]  23,98 90 top
RED5  150060RS75000  [CHIP-LED0603]  23,83 90 top
RED6  150060RS75000  [CHIP-LED0603]  23,84 90 top
RED7  150060RS75000  [CHIP-LED0603]  23,69 90 top
RED8  150060RS75000  [CHIP-LED0603]  23,70 90 top
RED9  150060RS75000  [CHIP-LED0603]  57,107 270 top
RED10  150060RS75000  [CHIP-LED0603]  57,106 270 top
RED11  150060RS75000  [CHIP-LED0603]  57,93 270 top
RED12  150060RS75000  [CHIP-LED0603]  57,92 270 top
RED13  150060RS75000  [CHIP-LED0603]  57,79 270 top
RED14  150060RS75000  [CHIP-LED0603]  57,78 270 top
RED15  150060RS75000  [CHIP-LED0603]  57,65 270 top
RED16  150060RS75000  [CHIP-LED0603]  57,64 270 top
RED17  150060RS75000  [CHIP-LED0603]  25.25,36.75 180 top
RED18  150060RS75000  [CHIP-LED0603]  60.25,37 180 top
RED19  150060RS75000  [CHIP-LED0603]  14,166.5 0 top
RED20  150060RS75000  [CHIP-LED0603]  15,166.5 0 top
RED21  150060RS75000  [CHIP-LED0603]  23,166.5 0 top
RED22  150060RS75000  [CHIP-LED0603]  24,166.5 0 top
RED23  150060RS75000  [CHIP-LED0603]  32,166.49 0 top
RED24  150060RS75000  [CHIP-LED0603]  33,166.49 0 top
RED25  150060RS75000  [CHIP-LED0603]  41,166.5 0 top
RED26  150060RS75000  [CHIP-LED0603]  42,166.5 0 top
RED27  150060RS75000  [CHIP-LED0603]  50,166.5 0 top
RED28  150060RS75000  [CHIP-LED0603]  51,166.5 0 top
RED29  150060RS75000  [CHIP-LED0603]  59,166.5 0 top
RED30  150060RS75000  [CHIP-LED0603]  60,166.5 0 top
RED31  150060RS75000  [CHIP-LED0603]  68,166.5 0 top
RED32  150060RS75000  [CHIP-LED0603]  69,166.5 0 top
RED33  150060RS75000  [CHIP-LED0603]  22.25,148.5 0 top
RED34  150060RS75000  [CHIP-LED0603]  23.25,148.5 0 top
RED35  150060RS75000  [CHIP-LED0603]  32,148.5 0 top
RED36  150060RS75000  [CHIP-LED0603]  33,148.5 0 top
RED37  150060RS75000  [CHIP-LED0603]  41,148.5 0 top
RED38  150060RS75000  [CHIP-LED0603]  42,148.5 0 top
RED39  150060RS75000  [CHIP-LED0603]  50,148.5 0 top
RED40  150060RS75000  [CHIP-LED0603]  51,148.5 0 top
RED41  150060RS75000  [CHIP-LED0603]  59,148.5 0 top
RED42  150060RS75000  [CHIP-LED0603]  60,148.5 0 top
RED43  150060RS75000  [CHIP-LED0603]  68,148.5 0 top
RED44  150060RS75000  [CHIP-LED0603]  69,148.5 0 top
RED45  150060RS75000  [CHIP-LED0603]  42.25,136.5 270 top
RED46  150060RS75000  [CHIP-LED0603]  42.25,135.5 270 top
RED47  150060RS75000  [CHIP-LED0603]  57.25,136.5 270 top
RED48  150060RS75000  [CHIP-LED0603]  57.25,135.5 270 top
RED49  150060RS75000  [CHIP-LED0603]  57.25,125 270 top
RED50  150060RS75000  [CHIP-LED0603]  57.25,124 270 top
RED51  150060RS75000  [CHIP-LED0603]  14,237.5 0 top
RED52  150060RS75000  [CHIP-LED0603]  15,237.5 0 top
RED53  150060RS75000  [CHIP-LED0603]  23,237.5 0 top
RED54  150060RS75000  [CHIP-LED0603]  24,237.5 0 top
RED55  150060RS75000  [CHIP-LED0603]  32,237.49 0 top
RED56  150060RS75000  [CHIP-LED0603]  33,237.49 0 top
RED57  150060RS75000  [CHIP-LED0603]  41,237.5 0 top
RED58  150060RS75000  [CHIP-LED0603]  42,237.5 0 top
RED59  150060RS75000  [CHIP-LED0603]  50,237.5 0 top
RED60  150060RS75000  [CHIP-LED0603]  51,237.5 0 top
RED61  150060RS75000  [CHIP-LED0603]  59,237.5 0 top
RED62  150060RS75000  [CHIP-LED0603]  60,237.5 0 top
RED63  150060RS75000  [CHIP-LED0603]  68,237.5 0 top
RED64  150060RS75000  [CHIP-LED0603]  69,237.5 0 top
RED65  150060RS75000  [CHIP-LED0603]  22.25,219.5 0 top
RED66  150060RS75000  [CHIP-LED0603]  23.25,219.5 0 top
RED67  150060RS75000  [CHIP-LED0603]  32,219.5 0 top
RED68  150060RS75000  [CHIP-LED0603]  33,219.5 0 top
RED69  150060RS75000  [CHIP-LED0603]  41,219.5 0 top
RED70  150060RS75000  [CHIP-LED0603]  42,219.5 0 top
RED71  150060RS75000  [CHIP-LED0603]  50,219.5 0 top
RED72  150060RS75000  [CHIP-LED0603]  51,219.5 0 top
RED73  150060RS75000  [CHIP-LED0603]  59,219.5 0 top
RED74  150060RS75000  [CHIP-LED0603]  60,219.5 0 top
RED75  150060RS75000  [CHIP-LED0603]  68,219.5 0 top
RED76  150060RS75000  [CHIP-LED0603]  69,219.5 0 top
RED77  150060RS75000  [CHIP-LED0603]  42.25,207.5 270 top
RED78  150060RS75000  [CHIP-LED0603]  42.25,206.5 270 top
RED79  150060RS75000  [CHIP-LED0603]  57.25,207.5 270 top
RED80  150060RS75000  [CHIP-LED0603]  57.25,206.5 270 top
RED81  150060RS75000  [CHIP-LED0603]  57.25,196 270 top
RED82  150060RS75000  [CHIP-LED0603]  57.25,195 270 top
S1  [TAST_SMD]  73,13.5 180 top
SJ1  [SJ_2]  37,24.25 0 bottom
SJ2  [SJ_2]  33,27.25 0 bottom
SJ3  [SJ_2]  32.75,140.5 0 bottom
SJ4  [SJ_2]  32.75,138 0 bottom
SJ5  [SJ_2]  32.75,134.5 0 bottom
SJ6  [SJ_2]  28.75,139.5 270 bottom
SJ7  [SJ_2]  29,64 180 top
SJ8  [SJ_2]  28.75,134 270 bottom
SJ9  [SJ_2]  32.75,211.5 0 bottom
SJ10  [SJ_2]  32.75,209 0 bottom
SJ11  [SJ_2]  32.75,205.5 0 bottom
SJ12  [SJ_2]  28.75,210.5 270 bottom
SJ13  [SJ_2]  28.75,205 270 bottom
STIM_LOAD_OUT_N  [3,81/1,4]  45,70.75 270 top
STIM_LOAD_OUT_P  [3,81/1,4]  35,70.75 90 top
TP14  TESTPOINT_TH  [TP1-09]  67,52.25 90 top
U1  LT1790BCS6-2.5#TRMPBF  [SOT95P280X100-6N]  46.75,42.75 180 top
U2  STM32F4XXR  [LQFP64-10X10MM]  61,25 180 top
U3  TCA9535PWR  [SOP65P640X120-24N]  32.75,138.5 180 top
U4  TCA9535PWR  [SOP65P640X120-24N]  32.75,209.5 180 top
U$1  [4,1]  73,7 0 top
U$2  [4,1]  7,7 0 top
U$3  [4,1]  7,102 0 top
U$4  [4,1]  73,102 0 top
U$5  [3,2]  71,121 90 top
U$6  [3,2]  18,121 90 top
U$7  [3,2]  9,182.5 90 top
U$8  [3,2]  71,182.5 90 top
U$9  [3,2]  71,192 90 top
U$10  [3,2]  18,192 90 top
U$11  [3,2]  9,253.5 90 top
U$12  [3,2]  71,253.5 90 top
USB1  1-1734035-1  [TE_1-1734035-1]  43,-0.5 0 top
X1  22-23-2041  [22-23-2041]  40.05,81 0 top
X2  PINHD-1X66X1.27  [1.27_1X06_S]  62.25,12.25 0 top
X3  PINHD-1X66X1.27  [1.27_1X06_S]  59.5,8.5 0 top
X4  22-23-2021  [22-23-2021]  38.75,12.25 0 top
XS1  WIREPAD3,81/1,4  [3,81/1,4]  22,103 0 top
XS2  WIREPAD3,81/1,4  [3,81/1,4]  22,89 270 top
XS3  WIREPAD3,81/1,4  [3,81/1,4]  22,75 270 top
XS4  WIREPAD3,81/1,4  [3,81/1,4]  22,61 270 top
XS5  WIREPAD3,81/1,4  [3,81/1,4]  58,103 90 top
XS6  WIREPAD3,81/1,4  [3,81/1,4]  58,89 90 top
XS7  WIREPAD3,81/1,4  [3,81/1,4]  58,75 90 top
XS8  WIREPAD3,81/1,4  [3,81/1,4]  58,61 90 top

## Tracks (layer width: path | path; a pad name or v marks a point on that pad's centre or on a via)
2XVREF
  Top 0.4: OP3.2 OP3.1 51.7,52.55 R106.2
2XVREF1
  Top 0.4: OP1.2 OP1.1 28.3,47.45 R8.2
!INT
  Top 0.3: R133.2 R134.2 | U3.1 35.67,133.18 R134.2 | 34.9,133 R133.2 | R134.2 R135.2 R136.2 39.25,133.25 39.5,133.5 39.5,134.4 R132.1 | 34.65,133 R133.2
!INT_2
  Top 0.3: R204.2 R205.2 | U4.1 35.67,204.18 R205.2 | 34.9,204 R204.2 | R205.2 R206.2 R207.2 39.25,204.25 39.5,204.5 39.5,205.4 R203.1 | 34.65,204 R204.2
+3V3  (via drill 0.3)
  Top 0.2: ADC1.9 38.75,45.75 38.25,45.25 38,45.25 37.75,45.25 C28.1 37.76,45.13
  Top 0.3: R1COMP2.1 18.88,39.02 COMP3.8 20.48,39.02 21,38.5 21,38.25 | 21,37.62 C35.1 | R1COMP4.1 54.38,39.02 COMP1.8 56.23,39.02 | 56.23,39.02 56.75,38.5 v56.75,38.4 | v36.5,36.75 35.12,38.12 35.12,43.88 36.5,45.25 37,45.25 37.12,45.13 37.76,45.13 | 38,45.25 38.62,45.88 | U2.48 54.12,21.25 C31.1 | 65,19.25 65.88,19.25 C30.1 66,19.12 66,19.25 66,19.5 66.75,20.25 U2.1 71.33,21.25 OSC1.4 71.36,19.04 C67.1 71.5,18.89 v72.5,18.89 73.72,20.1 75.25,20.1 R33.1 R32.1 | U2.19 63.75,30 64,29.75 66,29.75 | v70.7,14.2 R14.2 | X3.P1 59.63,12.12 | 59.63,12.12 59.75,12 | 59.63,12.12 59.5,12.25 59.5,13 58.25,14.25 v58.25,14.5 | U2.64 65,19.25 | 65,19.25 v66,20.25 | U2.32 57.25,31.75 v57.1,31.85 57,31.75 | U2.32 57.25,30.5 56.38,30.5 C33.1 | U2.32 56.25,30.75 | R1COMP1.1 27.6,37.9 v28,37.5 | U2.13 68.5,27.25 v68.6,27.35 | 56.23,39.02 56.23,38.52 56.25,38.5 | R1COMP3.1 64.35,39.75 v66,39.75
  Top 0.5: 52.88,20.88 v52.75,20.75 | v26.5,24.75 26.25,24.75 | 26,25.88 C5.1 | 25.95,24.45 26,24.5 | C36.1 56.1,37.75 v56.75,38.4 | 56.25,38 56.25,38.5 56.25,38.75
  Top 0.6: 13.5,92.5 13.5,105.25 12.29,106.46 OK9.6 10.9,106.75 9.75,106.75 8.6,107.9 6.25,107.9 R26.1 | 13.5,92.5 13.5,78.25 | 13.5,78.25 13.5,73 | 13.5,73 13.5,65.75 12.25,64.5 11.23,64.5 OK7.6 9.46,64.46 | 13.5,78.25 13.29,78.46 OK6.6 10.88,78.15 R16.1 | 13.5,92.5 13.46,92.46 OK4.6 10.88,92.15 R12.1 | R18.1 13.5,73 | 66.5,97.5 66.5,110.75 67.29,111.54 OK21.6 69.12,111.85 R47.1 | 66.5,97.5 66.5,83.5 | 66.5,83.5 66.5,83.25 | 66.5,83.25 66.5,70.75 | 66.5,70.75 67.75,69.5 68.77,69.5 OK24.6 | 66.5,70.75 66.5,63.75 | 66.5,63.75 v66.5,63.25 | 66.54,83.54 66.5,83.5 | R52.1 69.12,83.85 OK23.6 66.79,83.54 66.5,83.25 | 66.5,97.5 66.54,97.54 OK22.6 69.71,97.54 71.25,96 73.9,96 R50.1 | 21,37.62 21,38.25 21.5,38.75 v21.75,38.75 | 9.46,64.46 9.5,64.5 | 9.46,64.46 7,62 v7,61.5 | J1.3 72.69,54.8 70.5,57 | R54.1 67.5,62.75 66.5,63.75 | C31.1 52.88,20.88 | 26.25,24.75 26,24.5 26,25.88 | LDO1.5 25.95,24.45 | v52,20.75 v52.75,20.75 53.5,20.75 | v66,41.75 70.5,46.25 70.5,57 | 70.5,57 v70.25,57.25 | 66,29.75 C34.1 66.25,29.75 v66,30 | 57,31.75 57,31 56.75,31 | C5.1 26.25,26 27.25,25 v27.25,24 | v2.75,29 4.5,27.25 17,27.25 18.25,26 v18.25,25.5 | v68.6,27.35 69.28,27.35 C32.1 | v66,20.25 66,19.25 | 66,19.25 66,19 | 66,19.25 65.75,19.25 | 65,19.25 65.75,19.25 | 65.75,19.25 65.75,19.5
  Bottom 0.3: v72.5,18.89 72.5,16 v70.7,14.2 70.75,14.15 | v58.25,14.5 57.25,14.5 57,14.75 57.12,14.75 C41.1 56.85,15.03 ISO_1.16 55.45,16.3 55,16.75 53.25,16.75 52.75,16.25 | 52.75,16.25 52.75,15.18 ISO_1.14 ISO_1.13 ISO_1.12 | 52.75,16.25 v52.75,20.75 | v56.75,38.4 56.75,32.2 v57.1,31.85 | v28,37.5 27.5,37 | R34.1 1.75,35 1.75,34.75 | R35.1 1.75,33.5 1.75,33.25 | R37.1 1.75,32 | R36.1 1.75,30.5
  Bottom 0.6: v7,61.5 7,56 6,55 4.19,55 J3.5 2.31,54.81 1.75,54.25 1.75,34.75 1.75,33.25 1.75,32 1.75,30.5 1.75,30 v2.75,29 | v70.25,57.25 70.25,59.5 v66.5,63.25 | v27.25,24 27.25,22.5 30.25,19.5 42.25,19.5 43.5,20.75 v52.75,20.75 53.25,20.25 v66,20.25 66,27 | v27.25,24 v26.5,24.75 | 66,27 v66,30 66,31.25 | 66,31.25 v66,39.75 v66,41.75 v66.5,42.25 | v57.1,31.85 57.25,31.75 65.5,31.75 66,31.25 | v27.25,24 27.25,37 | 27.25,37 26.25,38 22.5,38 v21.75,38.75 | 27.25,37 27.5,37 36.25,37 v36.5,36.75 | v18.25,25.5 18.25,25 19,24.25 27,24.25 v27.25,24 | 66,27 68.25,27 v68.6,27.35
  pour Top (isolate 0.4, no thermals): 25.5,24 25.5,25.25 26.75,26.25 27.25,26.25 27.5,26 27.5,24.25 27,23.75 25.75,23.75
+3V3_1  (via drill 0.3)
  Top 0.3: U3.24 29.67,134.92 29.25,134.5 29.25,132.88 C73.1 30.25,132.88 | v30.25,133.5 30.25,132.88 | 30.25,132.88 30.25,132.75 | 62.5,176.75 62.62,176.88 v63.12,176.88 63.5,177.25 | v36.46,176.75 36.46,176.96 36.25,176.75 | R132.2 38.15,135.6 v38,135.75
  Top 0.6: J2.5 J4.5 35.19,127.31 32,130.5 32,131 31.5,131.5 | OK0.6 9.46,177.29 10,176.75 v18.5,176.75 | v18.5,176.75 v27.5,176.75 | v27.5,176.75 36.25,176.75 v36.46,176.75 | v36.46,176.75 36.5,176.75 | 36.5,176.75 v45.5,176.75 | v45.5,176.75 v54.5,176.75 | v54.5,176.75 62.5,176.75 63,176.75 | 63.5,177.25 63.5,178.35 OK10.6 | OK8.6 54.46,176.79 v54.5,176.75 | OK5.6 45.46,176.79 v45.5,176.75 | OK3.6 v36.46,176.75 | v36.46,176.75 36.46,176.79 36.5,176.75 | OK2.6 27.46,176.79 v27.5,176.75 | OK1.6 18.46,176.79 v18.5,176.75 | OK11.6 17.71,159.29 18.25,158.75 v27.5,158.75 | v27.5,158.75 v36.5,158.75 | v36.5,158.75 v45.5,158.75 | v45.5,158.75 v54.5,158.75 | v54.5,158.75 63.25,158.75 | OK16.6 63.5,160.35 63.5,159.25 v63.25,159 63.25,158.75 | OK15.6 54.46,158.79 v54.5,158.75 | OK14.6 45.46,158.79 v45.5,158.75 | OK13.6 36.46,158.79 v36.5,158.75 | OK12.6 27.46,158.79 v27.5,158.75 | OK19.6 69,130 68,130 v67.5,130.5 v67.5,131.75 v67.5,139.5 67.5,140.5 68,141 69.11,141 OK18.6 | 69.19,141 OK18.6 | v52.5,139.5 52.5,140.75 | OK17.6 54.1,141 52.75,141 52.5,140.75 | 30.25,132.5 30.25,132.75 31.5,131.5 | v63.12,176.88 63,176.75 | 63,176.75 70.25,176.75 72.75,174.25 72.75,157.5 | OK18.6 69.44,140.75 70.5,140.75 72.75,143 72.75,157.5 | 52.5,140.75 51.25,139.5 51.25,135.5 v51.5,135.25 | v32.25,131.5 31.5,131.5 | 63.25,158.75 64,158 72.25,158 72.75,157.5
  Bottom 0.3: R71.1 64.1,177.85 v63.12,176.88 63.5,176.5 R75.1 | R67.1 54.85,177.1 v54.5,176.75 | R63.1 45.85,177.1 v45.5,176.75 | R59.1 36.85,177.14 v36.46,176.75 | R55.1 27.85,177.1 v27.5,176.75 | R42.1 18.85,177.1 v18.5,176.75 | R82.1 27.85,159.1 v27.5,158.75 | R93.1 36.85,159.1 v36.5,158.75 | R97.1 45.85,159.1 v45.5,158.75 | R101.1 54.85,159.1 v54.5,158.75 | R113.1 63.85,159.6 v63.25,159 R117.1 | R121.1 42.65,139.15 43,139.5 v52.5,139.5 | R129.1 68.1,129.9 v67.5,130.5 | R125.1 68.1,132.35 v67.5,131.75 | v30.25,133.5 31.23,134.48 SJ5.3 SJ4.3 SJ3.3 | v38,135.75 38,134.25
  Bottom 0.6: v52.5,139.5 v67.5,139.5 | v51.5,135.25 39,135.25 38,134.25 35.25,131.5 v32.25,131.5
+3V3_2  (via drill 0.3)
  Top 0.3: U4.24 29.67,205.92 29.25,205.5 29.25,203.88 C90.1 30.25,203.88 | v30.25,204.5 30.25,203.88 | 30.25,203.88 30.25,203.75 | 62.5,247.75 62.63,247.88 v63.13,247.88 63.5,248.25 | v36.46,247.75 36.46,247.96 36.25,247.75 | R203.2 38.15,206.6 v38,206.75
  Top 0.6: J5.5 J6.5 35.19,198.31 32,201.5 32,202 31.5,202.5 | OK20.6 9.46,248.29 10,247.75 v18.5,247.75 | v18.5,247.75 v27.5,247.75 | v27.5,247.75 36.25,247.75 v36.46,247.75 | v36.46,247.75 36.5,247.75 | 36.5,247.75 v45.5,247.75 | v45.5,247.75 v54.5,247.75 | v54.5,247.75 62.5,247.75 63,247.75 | 63.5,248.25 63.5,249.35 OK30.6 | OK29.6 54.46,247.79 v54.5,247.75 | OK28.6 45.46,247.79 v45.5,247.75 | OK27.6 v36.46,247.75 | v36.46,247.75 36.46,247.79 36.5,247.75 | OK26.6 27.46,247.79 v27.5,247.75 | OK25.6 18.46,247.79 v18.5,247.75 | OK31.6 17.71,230.29 18.25,229.75 v27.5,229.75 | v27.5,229.75 v36.5,229.75 | v36.5,229.75 v45.5,229.75 | v45.5,229.75 v54.5,229.75 | v54.5,229.75 63.25,229.75 | OK36.6 63.5,231.35 63.5,230.25 v63.25,230 63.25,229.75 | OK35.6 54.46,229.79 v54.5,229.75 | OK34.6 45.46,229.79 v45.5,229.75 | OK33.6 36.46,229.79 v36.5,229.75 | OK32.6 27.46,229.79 v27.5,229.75 | OK39.6 69,201 68,201 v67.5,201.5 v67.5,202.75 v67.5,210.5 67.5,211.5 68,212 69.11,212 OK38.6 | 69.19,212 OK38.6 | v52.5,210.5 52.5,211.75 | OK37.6 54.11,212 52.75,212 52.5,211.75 | 30.25,203.5 30.25,203.75 31.5,202.5 | v63.13,247.88 63,247.75 | 63,247.75 70.25,247.75 72.75,245.25 72.75,228.5 | OK38.6 69.44,211.75 70.5,211.75 72.75,214 72.75,228.5 | 52.5,211.75 51.25,210.5 51.25,206.5 v51.5,206.25 | v32.25,202.5 31.5,202.5 | 63.25,229.75 64,229 72.25,229 72.75,228.5
  Bottom 0.3: R160.1 64.1,248.85 v63.13,247.88 63.5,247.5 R164.1 | R156.1 54.85,248.1 v54.5,247.75 | R152.1 45.85,248.1 v45.5,247.75 | R148.1 36.85,248.14 v36.46,247.75 | R144.1 27.85,248.1 v27.5,247.75 | R140.1 18.85,248.1 v18.5,247.75 | R168.1 27.85,230.1 v27.5,229.75 | R172.1 36.85,230.1 v36.5,229.75 | R176.1 45.85,230.1 v45.5,229.75 | R180.1 54.85,230.1 v54.5,229.75 | R184.1 63.85,230.6 v63.25,230 R188.1 | R192.1 42.65,210.15 43,210.5 v52.5,210.5 | R200.1 68.1,200.9 v67.5,201.5 | R196.1 68.1,203.35 v67.5,202.75 | v30.25,204.5 31.23,205.48 SJ11.3 SJ10.3 SJ9.3 | v38,206.75 38,205.25
  Bottom 0.6: v52.5,210.5 v67.5,210.5 | v51.5,206.25 39,206.25 38,205.25 35.25,202.5 v32.25,202.5
+5V  (via drill 0.3)
  Top 0.25: ADC1.15 42.25,46.75 43,46 44.24,46 C25.1
  Top 0.4: 55.88,51.38 C11.1 55.88,54.62 v55.75,54.75 | OP3.8 55.88,51.3 55.88,51.38 | OP4.8 63.48,48.23 63.75,48.5 | 63.75,48.5 65.38,48.5 C12.1 | OP1.8 24.48,48.77 24.75,48.5 | 24.75,48.5 24.75,47.38 C8.1 | OP2.8 16.95,52.12 C10.1 v15.5,51 | 63.75,48.5 v64.25,49 | v25.25,48.5 24.75,48.5 | v55.75,56.25 54.75,57.25 53.65,57.25 D2.2 | 55.88,51.38 56.38,51.38 v56.75,51.75 | 45.61,44.73 45.61,45.11 | 45.62,45.12 45.75,45.25 | 45.75,45.25 v46.5,46 | U1.4 45.61,44.73 | 45.61,44.73 C20.1 45.88,45.12 45.62,45.12 | 45.62,45.12 45.61,45.11 | v44.75,44.5 45,44.5 45.61,45.11 | 45.75,45.25 | 45.75,45.25 C25.1 | v26.5,55 26.75,54.75 27.45,54.75 D1.2
  Top 0.5: C49.1 2,20 2.5,20.5 4,20.5 4.05,20.45 LDO2.5 4.05,20.55 v5,21.5 v5,22.5 | v15.5,51 15.5,50.25 v14.25,49
  Bottom 0.4: v64.25,49 57.25,42 48,42 46,40 42.25,40 | 42.25,40 33.75,40 v25.25,48.5 22,51.75 16.5,51.75 15.5,52.75 | 42.25,40 44.75,42.5 v44.75,44.5 45,44.5 v46.5,46 55,46 56.75,47.75 v56.75,51.75 | v55.75,54.75 v55.75,56.25 | v26.5,55 26.25,54.75 17.5,54.75 15.5,52.75 | 15.5,52.75 v15.5,51
  Bottom 0.5: v14.25,49 14.25,45.5 13.5,44.75 13.5,32 5,23.5 v5,21.5
  pour Top (isolate 0.2, no thermals): 41.75,46.75 42,46.5 42,46 42.5,45.5 45,45.5 45.5,45 46.25,45.75 46.25,46 45.75,46 44.75,47 44,46.25 42.75,46.25 42.25,46.75
+5V_IN
  Top 0.3: LDO1.3 20.9,22.55
  Top 0.4: 22.65,24.5 LDO1.1 | 18.75,20.75 20,20.75 21,21.75 21,22.35 C47.1 | 20.9,22.55 C47.1 | C47.1 21,22.65 21,24.35 R83.1 22.5,24.5 22.38,24.62 C2.1
  Top 0.8: DC-DC_3V3.7 16.76,18.76 18.75,20.75
  pour Top (isolate 0.4, no thermals): 21,25 21.5,25 22,25.5 22,26.5 23,26.5 23,24.5 22,24.5 21.5,24 21.5,22 18,18.5 18,13 17.5,12.5 16.5,12.5 15.5,13.5 15.5,18.25 18.5,21.25 20,21.25 20.5,21.75 20.5,24.5
+5V_USB  (via drill 0.3)
  Top 0.3: 40.5,9.5 40.5,12.25 41.5,13.25 44.25,13.25 44.5,13 44.5,12.25 45.25,11.5 IC1.5
  Top 0.5: USB1.1 41.4,8.6 v40.75,9.25 40.5,9.5 37.75,9.5
  Top 0.7: DC-DC_9V.1 32.75,2.25 35.25,2.25 35,2.5 C44.1 | DC-DC_3V3.1 32,11 33.5,9.5 34.85,9.5 C52.1 35.35,9.65 35.5,9.5 37.5,9.5
  Bottom 0.5: C39.1 55.45,2.57 ISO_1.1 55.45,6.3 54.75,7 43,7 v40.75,9.25
  pour Top (isolate 0.3, no thermals): 41.25,6.3 40.5,6.3 40.5,8.25 39.5,9.25 37.75,9.25 37.25,8.75 37.25,1.75 36.75,1.25 31.5,1.25 31,1.75 31,3.75 31.5,4.25 32.5,4.25 33.25,3.5 35.5,3.5 36,4 36,6 31,11 31,14.5 31.5,15 32.5,15 33,14.5 33,11.5 34.25,10.25 39.5,10.25 39.5,11.25 40.5,11.25 40.5,10.25 41.25,9.5
+9V
  Top 0.3: C43.1 12.4,9.6
  Top 0.5: C50.1 5.95,15.68 LDO2.3 5.95,18.05 5.5,18.5 4.5,18.5 4.05,18.05 LDO2.1
  Top 0.6: C50.1 6.12,13.88 6.5,13.5 5.35,13.5 R111.1
  Top 0.7: DC-DC_9V.6 17.5,3 13,7.5 13,8.77 C43.1 12.02,9.75 12,9.75 9.5,12.25 8.75,12.25 7.5,13.5 6.5,13.5
-5V  (via drill 0.3)
  Top 0.4: C15.2 51.7,47.92 OP3.4 50.48,49.27 49.75,50 49.75,54.25 v49.5,54.5 | OP4.4 61.52,52.23 60.5,53.25 60.5,54.12 C16.2 60.25,54.38 60.25,55 59.75,55.5 54.25,55.5 54.05,55.3 D2.1 52.8,55.3 v52,54.5 | OP1.4 28.3,52.2 C13.2 28.25,53 27.75,53.5 26.5,53.5 25.75,54.25 25.75,56 v26.25,56.5 27.6,56.5 D1.1 | C14.2 19.88,47.5 19.25,47.5 18.98,47.77 OP2.4 19.27,48.25 v19.75,48.25
  Top 0.5: LDO3.4 9.05,17.45 | v7.5,21.25 v7.5,22.5
  Top 0.6: 9.05,17.45 9.05,17.95 8.5,18.5 7.62,18.5 C65.1 v7.5,21.25
  Bottom 0.4: v52,54.5 v49.5,54.5 29,54.5 27,56.5 v26.25,56.5
  Bottom 0.5: v26.25,56.5 25.5,55.75 17,55.75 14.25,53 14.25,50 15.25,49 | 15.25,49 16,48.25 v19.75,48.25 | 15.25,49 15.25,45 14.5,44.25 14.5,30.5 7.5,23.5 v7.5,21.25
-9V
  Top 0.5: C66.1 11.38,17.88 11,17.5 11,17.25 LDO3.5
  Top 0.6: R15.2 13.35,15.85 13.5,16
  Top 0.7: DC-DC_9V.4 24.38,3.12 21,6.5 19.5,6.5 13.5,12.5 13.5,13 | 13.5,13 13.5,16 13.5,17.38 C66.1 | C51.2 13.1,13.4 13.5,13
ADC_CONVERSION  (via drill 0.3)
  Top 0.2: ADC1.5 39.25,48.75 39,49 37.75,49 33.5,44.75 v33.5,35.25
  Bottom 0.3: v33.5,35.25 33.5,28.5 33,28 SJ2.2
ADC_SCK  (via drill 0.3)
  Top 0.2: ADC1.10 39.25,45.25 37.75,43.75 37.75,43.25 36.75,42.25 36.75,39 38,37.75 42,37.75 v42.25,37.5
  Top 0.3: v43,30.5 47,30.5 46.9,30.4 46.9,30 R28.2
  Bottom 0.3: v42.25,37.5 42.25,31.25 v43,30.5
ADC_SDO_I  (via drill 0.3)
  Top 0.2: ADC1.7 36.75,47.25 34,44.5 34,35.75 34.5,35.25 v35.5,35.25
  Top 0.3: v38.75,27 43.75,27 43.9,26.85 R24.2
  Bottom 0.3: v35.5,35.25 35.5,30.25 v38.75,27
ADC_SDO_V  (via drill 0.3)
  Top 0.2: ADC1.8 37,46.75 34.5,44.25 34.5,36.25 v34.75,36
  Bottom 0.3: v34.75,36 34.75,29.75 36.75,27.75 36.75,24.5 SJ1.2
AGND  (via drill 0.3)
  Top 0.25: C25.2 43.01,47.25 ADC1.16 40.75,47.25 40.5,47 ADC1.EXP 40.25,46.75 ADC1.12 40.25,44.75 40,44.5 40,44.38
  Top 0.3: 11.5,12.5 11,12.5 9.5,14 9,14 8,15
  Top 0.4: v23.25,48.25 23.25,47.38 C8.2 | 40,42.12 40,44.38 | 42.62,47.38 44,48.75 45,47.75 | 44,47.75 44,48
  Top 0.5: 2,17.5 C49.2 | v12,21 13,20 C66.2 | 45,47.75 44,47.75
  Top 0.6: v30,42.5 29.25,43.25 17.25,43.25
  Top 0.7: DC-DC_9V.5 21.84,3.16 20,5 19,5 11.6,12.4 | 11.6,12.4 11.5,12.5 | C51.1 11.6,12.4
  Top 0.8: 44,48 44.25,48.25
  Top 1: R2V_ADJ.2 50,59 47,56
  Bottom 0.5: 15.5,32.25 15.5,29.5 9.25,23.25 9.25,21.5
  Bottom 0.6: v23.25,48.25 23.25,43.5 23.5,43.25 | 15.5,32.25 15.5,42.5 16.25,43.25
  other vias: 13.25,50.5 26.5,58 27.5,58 30.5,58 31.5,58 31.5,56.75 32.5,56.25 22,53.75 23,53.75 30.75,51.85 31.5,44 35.25,47.75 45.25,48 46,47.25 49.25,44 54.5,46.8 50.62,48.33 54.5,48.75 53.5,49.5 48.75,52.5 49.5,56 48.5,56 47.5,56 56.75,56.5 58.75,56.5 60,52.5 66.5,54 67,50.5 67,49 67,47.5 68.5,49 68.5,50.5 68.5,54 13.5,54 14.5,55 15.5,56 27,50.5 26,51 40,41 42,41.75 40,41.75 48.75,41 47.75,40 60.75,56 63,49.5 64.25,50.5 57.75,56.5 68.5,55 13.25,52.5 13.25,48.25 30.75,52.7 16.75,56.75 18.5,56.75 20.25,56.75 22,56.75 23.75,56.75 25.25,57.5 31.5,55.5 33.25,55.5 30.75,41.75 31.5,41 32.25,40.25 32.25,44.75 33,45.5 33.75,46.25 34.5,47 46.5,56 47,56.75 48,56.75 49,56.75 45.5,55.5 13.25,46.25 38.25,39 40,39 41.75,39 43.5,39 45.25,39 46.75,39 49.25,40 50,41 28.75,43.25 27.5,43.25 26.25,43.25 25,43.25 23.75,43.25 22.5,43.25 21.25,43.25 20,43.25 18.75,43.25 17.5,43.25 15.38,43.25 48.25,39
  pour Bottom (isolate 0.4, no thermals): 25.5,0 25.5,4.5 21,9 17.5,9 13.75,12.75 13.75,22.25 12.5,23.5 0,23.5 0,0
  pour Top (isolate 0.4, no thermals): 25.5,0 25.5,4.5 21,9 17.5,9 13.75,12.75 13.75,22.25 12.5,23.5 0,23.5 0,0
  pour Top (isolate 0.4, rank 2): 16,57 13,54 13,44.25 14.25,43 16,43 16,46.5 27.5,46.5 29.75,44.25 29.75,42.25 33.5,38.5 48.25,38.5 50.25,40.5 50.25,44.25 51.5,45.5 66.5,45.5 68.75,47.75 68.75,55.25 67,57 46.75,57 45.25,55.5 33.5,55.5 32,57 32,59 31.5,59.5 26.5,59.5 26,59 26,58.5 24.5,57
  pour Bottom (isolate 0.3): 16,57 13,54 13,46.25 16.25,43 29,43 33.5,38.5 48.25,38.5 50.5,40.75 61.75,40.75 68.75,47.75 68.75,55.25 66.25,57.75 60.25,57.75 59.75,57.25 56.25,57.25 55.75,57.75 47.5,57.75 45.25,55.5 33.5,55.5 32,57 32,59 31.5,59.5 26.5,59.5 26,59 26,58.5 24.5,57
  pour Bottom (isolate 0.3): 17,43.25 16,42.25 16,29.5 9.5,23 9.5,19.25 1.5,19.75 1.5,21.75 12.5,32.75 12.5,46.75 13.25,47.5 16,47.5 16,44 16.25,44
AIN1+
  Top 0.2: ADC1.4 39.75,51.5 38.75,52.5 36.25,52.5 35.75,52 35.75,51.51 C1.2
  Top 0.3: C1.2 R3.1 | C1.2 | C1.2 C38.2
AIN1-
  Top 0.2: ADC1.3 40.25,51.75 38.75,53.25 35.5,53.25 35,52.75 34.51,52.75 C1.1
  Top 0.3: R6.2 C1.1 34.12,52.62 C37.1
AIN2+
  Top 0.2: 45.13,52.62 44.5,53.25 42.25,53.25 40.75,51.75 ADC1.2
  Top 0.3: C42.1 R104.2 | 45.13,52.62 C42.1 45.75,52.75 45.75,53.25 46.38,53.88 C45.1
  Top 0.4: C42.1
AIN2-
  Top 0.2: ADC1.1 41.25,51.5 42.25,52.5 43.75,52.5 44.38,51.87
  Top 0.3: R85.1 C42.2 C46.2 | C42.2 44.38,51.87
  Top 0.4: C42.2
DC_X1  (via drill 0.3)
  Top 0.3: OK0.4 15.86,178.4 v16,178.25 | U3.14 26.83,141.42 v26.75,141.5